# Altium schematic sheet DRV8301_Gate_Driver_Buck.SchDoc
size A4; SheetNumber: 3; SheetTotal: 4
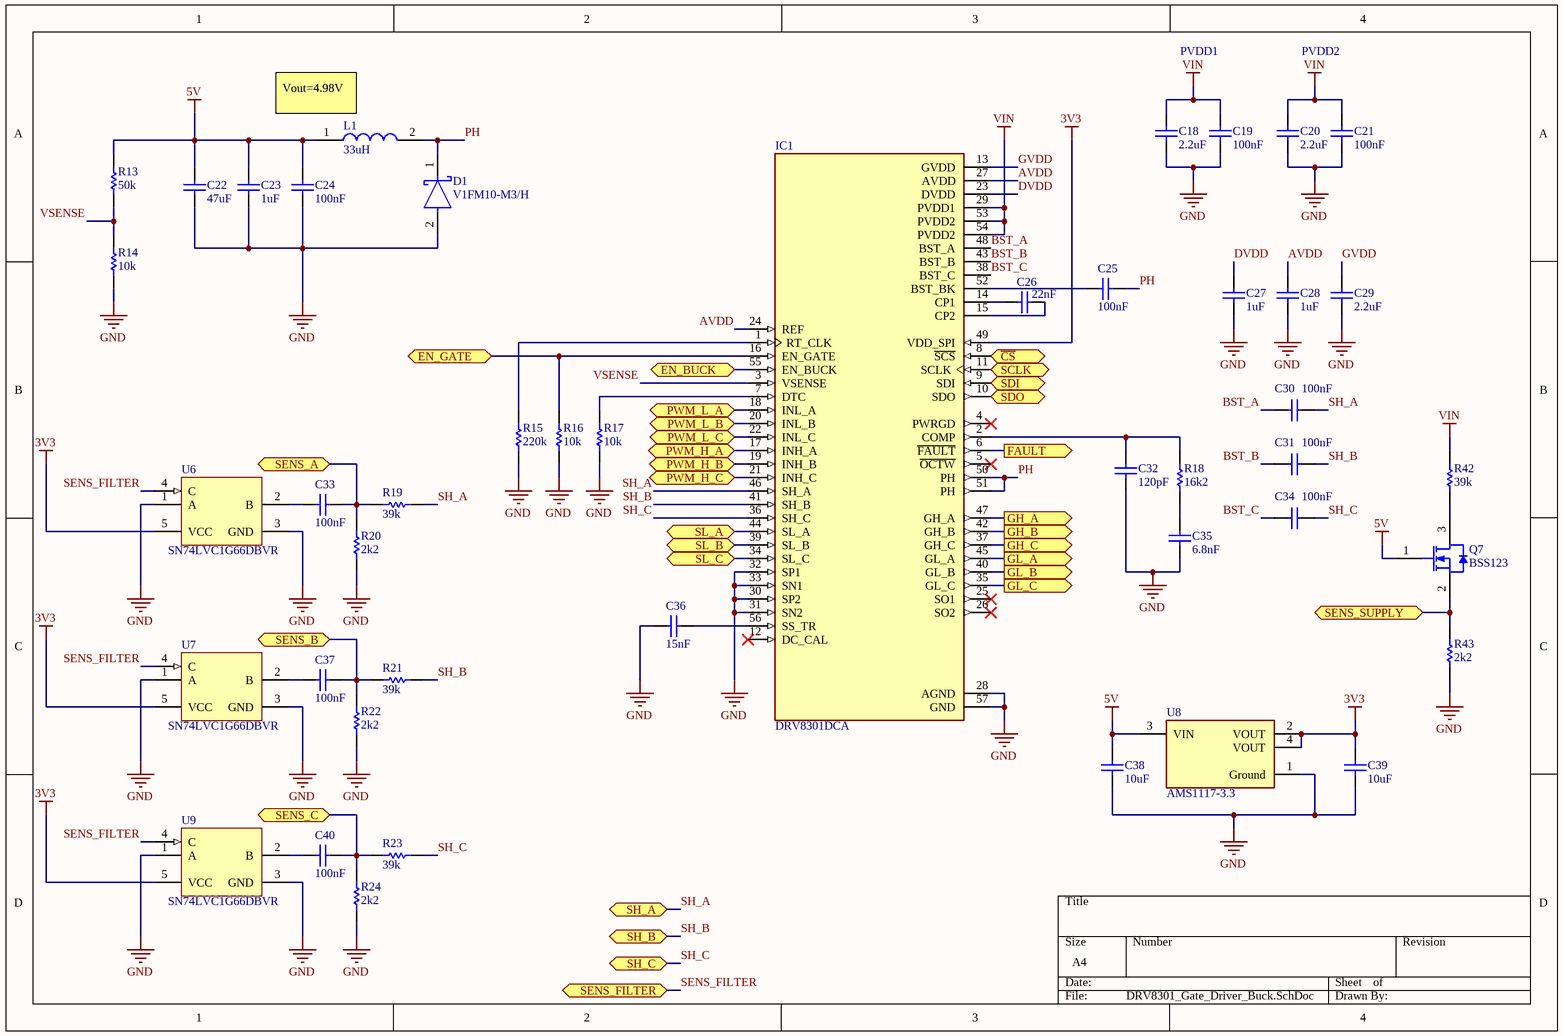
[diagram p0: DRV8301_Gate_Driver_Buck.SchDoc]

## Parts
C18  value 2.2uF  [Wurth 0603 capacitor]  (hidden comment: Generic Capacitor 2.2uF 0603)
C19  value 100nF  [Wurth 0603 capacitor]  (hidden comment: Generic Capacitor 100nF 0603)
C20  value 2.2uF  [Wurth 0603 capacitor]  (hidden comment: Generic Capacitor 2.2uF 0603)
C21  value 100nF  [Wurth 0603 capacitor]  (hidden comment: Generic Capacitor 100nF 0603)
C22  value 47uF  [Wurth 1206 Capacitor]  (hidden comment: Generic Capacitor 47uF 1206)
C23  value 1uF  [Wurth 0603 capacitor]  (hidden comment: Generic Capacitor 1uF 0603)
C24  value 100nF  [Wurth 0603 capacitor]  (hidden comment: Generic Capacitor 100nF 0603)
C25  value 100nF  [Wurth 0603 capacitor]  (hidden comment: Generic Capacitor 100nF 0603)
C26  value 22nF  [Wurth 0603 capacitor]  (hidden comment: Generic Capacitor 22nF 0603)
C27  value 1uF  [Wurth 0603 capacitor]  (hidden comment: Generic Capacitor 1uF 0603)
C28  value 1uF  [Wurth 0603 capacitor]  (hidden comment: Generic Capacitor 1uF 0603)
C29  value 2.2uF  [Wurth 0603 capacitor]  (hidden comment: Generic Capacitor 2.2uF 0603)
C30  value 100nF  [Wurth 0603 capacitor]  (hidden comment: Generic Capacitor 100nF 0603)
C31  value 100nF  [Wurth 0603 capacitor]  (hidden comment: Generic Capacitor 100nF 0603)
C32  value 120pF  [Wurth 0603 capacitor]  (hidden comment: Generic Capacitor 120pF 0603)
C33  value 100nF  [Wurth 0603 capacitor]  (hidden comment: Generic Capacitor 100nF 0603)
C34  value 100nF  [Wurth 0603 capacitor]  (hidden comment: Generic Capacitor 100nF 0603)
C35  value 6.8nF  [Wurth 0603 capacitor]  (hidden comment: Generic Capacitor 6.8nF 0603)
C36  value 15nF  [Wurth 0603 capacitor]  (hidden comment: Generic Capacitor 15nF 0603)
C37  value 100nF  [Wurth 0603 capacitor]  (hidden comment: Generic Capacitor 100nF 0603)
C38  value 10uF  [Wurth 0805 capacitor]  (hidden comment: Generic Capacitor 10uF 0805)
C39  value 10uF  [Wurth 0805 capacitor]  (hidden comment: Generic Capacitor 10uF 0805)
C40  value 100nF  [Wurth 0603 capacitor]  (hidden comment: Generic Capacitor 100nF 0603)
D1  V1FM10-M3/H  [FP-V1FM10-M3-H-MFG]
IC1  DRV8301DCA  [TI HTSSOP-56-6mm]
L1  value 33uH  [FH MS127-330MT]  (hidden comment: FH 33uH 3A)
Q7  BSS123  [FAIR-SOT23-3_V]
R13  value 50k  [Wurth 0603 Resistor]  (hidden comment: Generic Resistor 50k 0603)
R14  value 10k  [Wurth 0603 Resistor]  (hidden comment: Generic Resistor 10k 0603)
R15  value 220k  [Wurth 0603 Resistor]  (hidden comment: Generic Resistor 220k 0603)
R16  value 10k  [Wurth 0603 Resistor]  (hidden comment: Generic Resistor 10k 0603)
R17  value 10k  [Wurth 0603 Resistor]  (hidden comment: Generic Resistor 10k 0603)
R18  value 16k2  [Wurth 0603 Resistor]  (hidden comment: Generic Resistor 16k2 0603)
R19  value 39k  [Wurth 0603 Resistor]  (hidden comment: Generic Resistor 39k 0603)
R20  value 2k2  [Wurth 0603 Resistor]  (hidden comment: Generic Resistor 2k2 0603)
R21  value 39k  [Wurth 0603 Resistor]  (hidden comment: Generic Resistor 39k 0603)
R22  value 2k2  [Wurth 0603 Resistor]  (hidden comment: Generic Resistor 2k2 0603)
R23  value 39k  [Wurth 0603 Resistor]  (hidden comment: Generic Resistor 39k 0603)
R24  value 2k2  [Wurth 0603 Resistor]  (hidden comment: Generic Resistor 2k2 0603)
R42  value 39k  [Wurth 0603 Resistor]  (hidden comment: Generic Resistor 39k 0603)
R43  value 2k2  [Wurth 0603 Resistor]  (hidden comment: Generic Resistor 2k2 0603)
U6  SN74LVC1G66DBVR  [DBV0005A_L]
U7  SN74LVC1G66DBVR  [DBV0005A_L]
U8  AMS1117-3.3  [FP-AMS1117-IPC_C]
U9  SN74LVC1G66DBVR  [DBV0005A_L]

## Ports
EN_BUCK (bidir), EN_GATE (bidir), FAULT (out), GH_A (out), GH_B (out), GH_C (out), GL_A (out), GL_B (out), GL_C (out), PWM_H_A (bidir), PWM_H_B (bidir), PWM_H_C (bidir), PWM_L_A (bidir), PWM_L_B (bidir), PWM_L_C (bidir), SCLK (bidir), SDI (bidir), SDO (bidir), SENS_A (bidir), SENS_B (bidir), SENS_C (bidir), SENS_FILTER (bidir), SENS_SUPPLY (bidir), SH_A (bidir), SH_B (bidir), SH_C (bidir), SL_A (bidir), SL_B (bidir), SL_C (bidir), ~{CS} (bidir)

## Nets
3V3: C39.2 IC1.49(VDD_SPI) U6.5(VCC) U7.5(VCC) U8.2(VOUT) U8.4(VOUT) U9.5(VCC)
5V: C22.2 C23.2 C24.1 C38.2 L1.1 Q7.1(G) R13.2 U8.3(VIN)
GND: C18.1 C19.1 C20.1 C21.1 C22.1 C23.1 C24.2 C27.1 C28.1 C29.1 C32.1 C35.1 C36.1 C38.1 C39.1 D1.2(A) IC1.28(AGND) IC1.30(SP2) IC1.31(SN2) IC1.32(SP1) IC1.33(SN1) IC1.57(GND) R14.1 R15.1 R16.1 R17.1 R20.1 R22.1 R24.1 R43.1 U6.1(A) U6.3(GND) U7.1(A) U7.3(GND) U8.1(Ground) U9.1(A) U9.3(GND)
VIN: C18.2 C19.2 C20.2 C21.2 IC1.29(PVDD1) IC1.53(PVDD2) IC1.54(PVDD2) R42.2
AVDD: C28.2 IC1.24(REF) IC1.27(AVDD)
BST_A: C30.2 IC1.48(BST_A)
BST_B: C31.2 IC1.43(BST_B)
BST_C: C34.2 IC1.38(BST_C)
~{CS}: IC1.8(~{SCS}) ; port ~{CS}
DVDD: C27.2 IC1.23(DVDD)
EN_BUCK: IC1.55(EN_BUCK) ; port EN_BUCK
EN_GATE: IC1.16(EN_GATE) R16.2 ; port EN_GATE
FAULT: IC1.6(~{FAULT}) ; port FAULT
GH_A: IC1.47(GH_A) ; port GH_A
GH_B: IC1.42(GH_B) ; port GH_B
GH_C: IC1.37(GH_C) ; port GH_C
GL_A: IC1.45(GL_A) ; port GL_A
GL_B: IC1.40(GL_B) ; port GL_B
GL_C: IC1.35(GL_C) ; port GL_C
GVDD: C29.2 IC1.13(GVDD)
PH: C25.1 D1.1(C) IC1.50(PH) IC1.51(PH) L1.2
PWM_H_A: IC1.17(INH_A) ; port PWM_H_A
PWM_H_B: IC1.19(INH_B) ; port PWM_H_B
PWM_H_C: IC1.21(INH_C) ; port PWM_H_C
PWM_L_A: IC1.18(INL_A) ; port PWM_L_A
PWM_L_B: IC1.20(INL_B) ; port PWM_L_B
PWM_L_C: IC1.22(INL_C) ; port PWM_L_C
SCLK: IC1.11(SCLK) ; port SCLK
SDI: IC1.9(SDI) ; port SDI
SDO: IC1.10(SDO) ; port SDO
SENS_A: C33.1 R19.1 R20.2 ; port SENS_A
SENS_B: C37.1 R21.1 R22.2 ; port SENS_B
SENS_C: C40.1 R23.1 R24.2 ; port SENS_C
SENS_FILTER: U6.4(C) U7.4(C) U9.4(C) ; port SENS_FILTER
SENS_SUPPLY: Q7.2(S) R43.2 ; port SENS_SUPPLY
SH_A: C30.1 IC1.46(SH_A) R19.2 ; port SH_A
SH_B: C31.1 IC1.41(SH_B) R21.2 ; port SH_B
SH_C: C34.1 IC1.36(SH_C) R23.2 ; port SH_C
SL_A: IC1.44(SL_A) ; port SL_A
SL_B: IC1.39(SL_B) ; port SL_B
SL_C: IC1.34(SL_C) ; port SL_C
VSENSE: IC1.3(VSENSE) R13.1 R14.2
NetC25_2: C25.2 IC1.52(BST_BK)
NetC26_1: C26.1 IC1.14(CP1)
NetC26_2: C26.2 IC1.15(CP2)
NetC32_2: C32.2 IC1.2(COMP) R18.2
NetC33_2: C33.2 U6.2(B)
NetC35_2: C35.2 R18.1
NetC36_2: C36.2 IC1.56(SS_TR)
NetC37_2: C37.2 U7.2(B)
NetC40_2: C40.2 U9.2(B)
NetIC1_1: IC1.1(RT_CLK) R15.2
NetIC1_7: IC1.7(DTC) R17.2
NetQ7_3: Q7.3(D) R42.1

Not connected (* = marked no-connect by the designer): IC1 4(PWRGD)* 5(~{OCTW})* 12(DC_CAL)* 25(SO1)* 26(SO2)*

## Notes on the sheet
- (near L1) Vout=4.98V
- PVDD1
- PVDD2

## Library data of the parts
D1 = CMP-02539-000045-1: 1A 100V SMF TRENCH SKY RECT; RoHS Compliant: Yes
IC1 = DRV8301DCA: Power MOSFET Tube DRV8301 General Purpose motor driver 60V 1.7A 6.1mm -40C~125C TA; Manufacturer: Texas Instruments; Manufacturer Lifecycle Status: ACTIVE; Min Supply Voltage: 8V; Motor Type: Brushless DC (BLDC); Nominal Supply Current: 15mA; Number of Outputs: 1; Switching Frequency: 581kHz; Supplier: DigiKey; Supplier Part Number: 296-33274-5-ND; Manufacturer Part Number: DRV8301DCA; RoHS: Compliant; Category: Motor Drivers; Stock: 484; Pricing: 1=8,65, 10=6,719, 35=6,08629, 105=5,6881, 280=5,42282, 525=5,28747, 1015=5,16895 (USD); Case/Package: HTSSOP EP; Collector Emitter Voltage (VCEO): 60V; Height: 0m; Lead Free: Lead Free; Length: 14mm; Lifecycle Status: Production; Max Collector Current: 1.7A; Max Operating Temperature: 125°C; Max Supply Voltage: 60V; Min Operating Temperature: -40°C; Mounting Technology: Surface Mount; Pins: 56; Output Current: 1.7A; Radiation Hardening: No; REACH SVHC: No; Schedule B: 8542390000, 8542390000|8542390000|8542390000|8542390000|8542390000; Thickness: 1.15mm; Width: 6.1mm; ComponentLink1URL: https://sigma.octopart.com:443/184264061/technical_drawing/Texas-Instruments-DRV8301DCA.pdf?src-supplier=Texas+Instruments; ComponentLink1Description: https://sigma.octopart.com:443/184264061/technical_drawing/Texas-Instruments-DRV8301DCA.pdf?src-supplier=Texas+Instruments; ComponentLink2URL: https://octopart.com:443/opatz8j6/c1?t=8IUW2FYany34oJhLIyHX3Y1fI0NJBmozTUbG1CqNyPuNWTClGH-cr3TDyKeqxYPvaWCzT3FtFYre7m4Q0_NcEhaCaz4mrMBkw0JmabNj41SeHht1JXpUurlK2fwJkF59zymHjMraghvG0clGbmEpzk0-1Fi2LYVcqmMUSmJHOw8q5i15A0eOjXHAa3tkv_LsOMxXLpDcJMa_aqbVn0SPweYESkxUytDlv3TAlM6oY4J7IJJC2EjEwwEhPkQH_CuYhf8Ti-24CIEoT0h5OGCtdkTCzKVjqTotWSRYtTVQ0Tt15DGuyh5ljNo7b3BiePRRkOR3ODNP-x8tZIUca-sycMCq3AzyRFgJ2UNMLmvyduJzVS1Z3H-8J0ToKnTQpxkchCca5Q&src-supplier=Texas+Instruments; ComponentLink2Description: https://octopart.com:443/opatz8j6/c1?t=8IUW2FYany34oJhLIyHX3Y1fI0NJBmozTUbG1CqNyPuNWTClGH-cr3TDyKeqxYPvaWCzT3FtFYre7m4Q0_NcEhaCaz4mrMBkw0JmabNj41SeHht1JXpUurlK2fwJkF59zymHjMraghvG0clGbmEpzk0-1Fi2LYVcqmMUSmJHOw8q5i15A0eOjXHAa3tkv_LsOMxXLpDcJMa_aqbVn0SPweYESkxUytDlv3TAlM6oY4J7IJJC2EjEwwEhPkQH_CuYhf8Ti-24CIEoT0h5OGCtdkTCzKVjqTotWSRYtTVQ0Tt15DGuyh5ljNo7b3BiePRRkOR3ODNP-x8tZIUca-sycMCq3AzyRFgJ2UNMLmvyduJzVS1Z3H-8J0ToKnTQpxkchCca5Q&src-supplier=Texas+Instruments; ComponentLink3URL: https://datasheet.octopart.com:443/DRV8301DCA-Texas-Instruments-datasheet-17277489.pdf?src-supplier=Texas+Instruments; ComponentLink3Description: https://datasheet.octopart.com:443/DRV8301DCA-Texas-Instruments-datasheet-17277489.pdf?src-supplier=Texas+Instruments; ComponentLink4URL: https://datasheet.octopart.com:443/DRV8301DCA-Texas-Instruments-datasheet-15540827.pdf?src-supplier=Texas+Instruments; ComponentLink4Description: https://datasheet.octopart.com:443/DRV8301DCA-Texas-Instruments-datasheet-15540827.pdf?src-supplier=Texas+Instruments; ComponentLink5URL: https://datasheet.octopart.com:443/DRV8301DCA-Texas-Instruments-datasheet-11520822.pdf?src-supplier=Texas+Instruments; ComponentLink5Description: https://datasheet.octopart.com:443/DRV8301DCA-Texas-Instruments-datasheet-11520822.pdf?src-supplier=Texas+Instruments; ComponentLink6URL: https://sigma.octopart.com:443/49252451/technical_drawing/Texas-Instruments-DRV8301DCA.pdf?src-supplier=Texas+Instruments; ComponentLink6Description: https://sigma.octopart.com:443/49252451/technical_drawing/Texas-Instruments-DRV8301DCA.pdf?src-supplier=Texas+Instruments; ComponentLink7URL: https://datasheet.octopart.com:443/DRV8301DCA-Texas-Instruments-datasheet-37101717.pdf?src-supplier=Newark; ComponentLink7Description: https://datasheet.octopart.com:443/DRV8301DCA-Texas-Instruments-datasheet-37101717.pdf?src-supplier=Newark; ComponentLink8URL: https://datasheet.octopart.com:443/DRV8301DCA-Texas-Instruments-datasheet-33018439.pdf?src-supplier=Newark; ComponentLink8Description: https://datasheet.octopart.com:443/DRV8301DCA-Texas-Instruments-datasheet-33018439.pdf?src-supplier=Newark; ComponentLink9URL: https://datasheet.octopart.com:443/DRV8301DCA-Texas-Instruments-datasheet-10540733.pdf?src-supplier=Upverter; ComponentLink9Description: https://datasheet.octopart.com:443/DRV8301DCA-Texas-Instruments-datasheet-10540733.pdf?src-supplier=Upverter; ComponentLink10URL: https://datasheet.octopart.com:443/DRV8301DCA-Texas-Instruments-datasheet-102488708.pdf?src-supplier=Farnell; ComponentLink10Description: https://datasheet.octopart.com:443/DRV8301DCA-Texas-Instruments-datasheet-102488708.pdf?src-supplier=Farnell; ComponentLink11URL: https://datasheet.octopart.com:443/DRV8301DCA-Texas-Instruments-datasheet-163231296.pdf?src-supplier=SHENGYU+ELECTRONICS; ComponentLink11Description: https://datasheet.octopart.com:443/DRV8301DCA-Texas-Instruments-datasheet-163231296.pdf?src-supplier=SHENGYU+ELECTRONICS; ComponentLink12URL: https://datasheet.octopart.com:443/DRV8301DCA-Texas-Instruments-datasheet-154627238.pdf?src-supplier=IBE+SMT+Equipment; ComponentLink12Description: https://datasheet.octopart.com:443/DRV8301DCA-Texas-Instruments-datasheet-154627238.pdf?src-supplier=IBE+SMT+Equipment; ComponentLink13URL: http://sigma.octopart.com:80/conflict_mineral_statement/Texas-Instruments-company-63.pdf?src-supplier=Compliance+Statements; ComponentLink13Description: http://sigma.octopart.com:80/conflict_mineral_statement/Texas-Instruments-company-63.pdf?src-supplier=Compliance+Statements; ComponentLink14URL: http://sigma.octopart.com:80/reach_statement/Texas-Instruments-company-64.pdf?src-supplier=Compliance+Statements; ComponentLink14Description: http://sigma.octopart.com:80/reach_statement/Texas-Instruments-company-64.pdf?src-supplier=Compliance+Statements
Q7 = CMP-2000-04934-1: N-Channel Logic Level Enhancement Mode Field Effect Transistor, 1.7 V, -55 to 150 degC, 3-Pin SOT-23, RoHS, Tape and Reel; Manufacturer: Fairchild; Channel Type: N; Typical Turn-Off Delay Time: 17ns; Maximum Continuous Drain Current: 0.17A; Rad Hard: No; Typical Rise Time: 9ns; Typical Fall Time: 2.4ns; Maximum Gate Source Voltage: ±20V; Maximum Drain Source Voltage: 100V; Typical Turn-On Delay Time: 1.7ns; RDS-on: 6000@10VmOhm; Package Version: Rev. 12, 03/2016; Packaging: Tape&Reel; Package Reference: SOT23-3; Channel Mode: Enhancement; Operating Temperature: -55to150degC; Package Description: 3-Pin Small Outline Transistor, Body 2.92 x 1.325 mm, Pitch 0.95 mm; Category: MOSFET; Datasheet Version: Jun-03; Datasheet URL: https://www.fairchildsemi.com/datasheets/BS/BSS123.pdf; Manufacturer URL: https://www.fairchildsemi.com/; Mounting: SurfaceMount; Package: 3SOT-23; Package URL: http://www.fairchildsemi.com/dwg/MA/MA03D.pdf
U6 U7 U9 = CMP-0859-00173-3: Single Analog Switch, DBV0005A, LARGE T&R; Manufacturer: Texas Instruments; Output Drive (IOL/IOH)(Max)(mA): 32/-32; ICC @ Nom Voltage(Max)(mA): 0.01; VCC(Min)(V): 1.65; Rating: Catalog; Bits(#): 1; tpd @ Nom Voltage(Max)(ns): 2,1.2,0.8,0.6; Logic: True; Output Type: CMOS; Schmitt Trigger: No; Switch Configuration: SPST; Input Type: CMOS/TTL; F @ Nom Voltage(Max)(Mhz): 150; VCC(Max)(V): 5.5; Technology Family: LVC; Voltage(Nom)(V): 1.8,2.5,3.3,5; Operating Temperature Range(C): -40 to 85; Generic Part Number: SN74LVC1G66; DatasheetVersion: SCES323O; PackageReference: DBV0005A; Channels(#): 1; 3-State Output: No
U8 = CMP-209535-000001-1: LDO Voltage Regulators 1A, 3.3V; Manufacturer: Advanced Monolithic Systems; Dropout Voltage: 1.1V; Output Type: Fixed; Nominal Supply Current: 5mA; Max Power Dissipation: 1.2W; Max Supply Voltage: 15V; Number Of Outputs: 1; Standoff Height: 0.64mm; Max Junction Temp: +125°C; Height: 1.8mm; Package: AMS1117; Device Class L2: Power Management ICs; ComponentLink2Description: Datasheet; ComponentLink2URL: http://www.advanced-monolithic.com/pdf/ds1117.pdf; Category: IC; RoHS: TRUE; Automotive: No; Device Class L1: Integrated Circuits (ICs); Output Current: 1A; Device Class L3: Voltage Regulators - Linear; Temperature: -40°C to +125°C; Output Voltage: 3.3V; Manufacturer Part Number: AMS1117-3.3; Temperature Range Low: -40°C; Octopart: https://octopart.com/ams1117-3.3-advanced+monolithic+systems-25899300; Lead Free: Yes; Ipc Land Pattern Name: SOT229P700X180-4; Temperature Range High: +125°C